# Altium schematic sheet Current_Sense.SchDoc
size OrCAD B; SheetNumber: 9; SheetTotal: 11
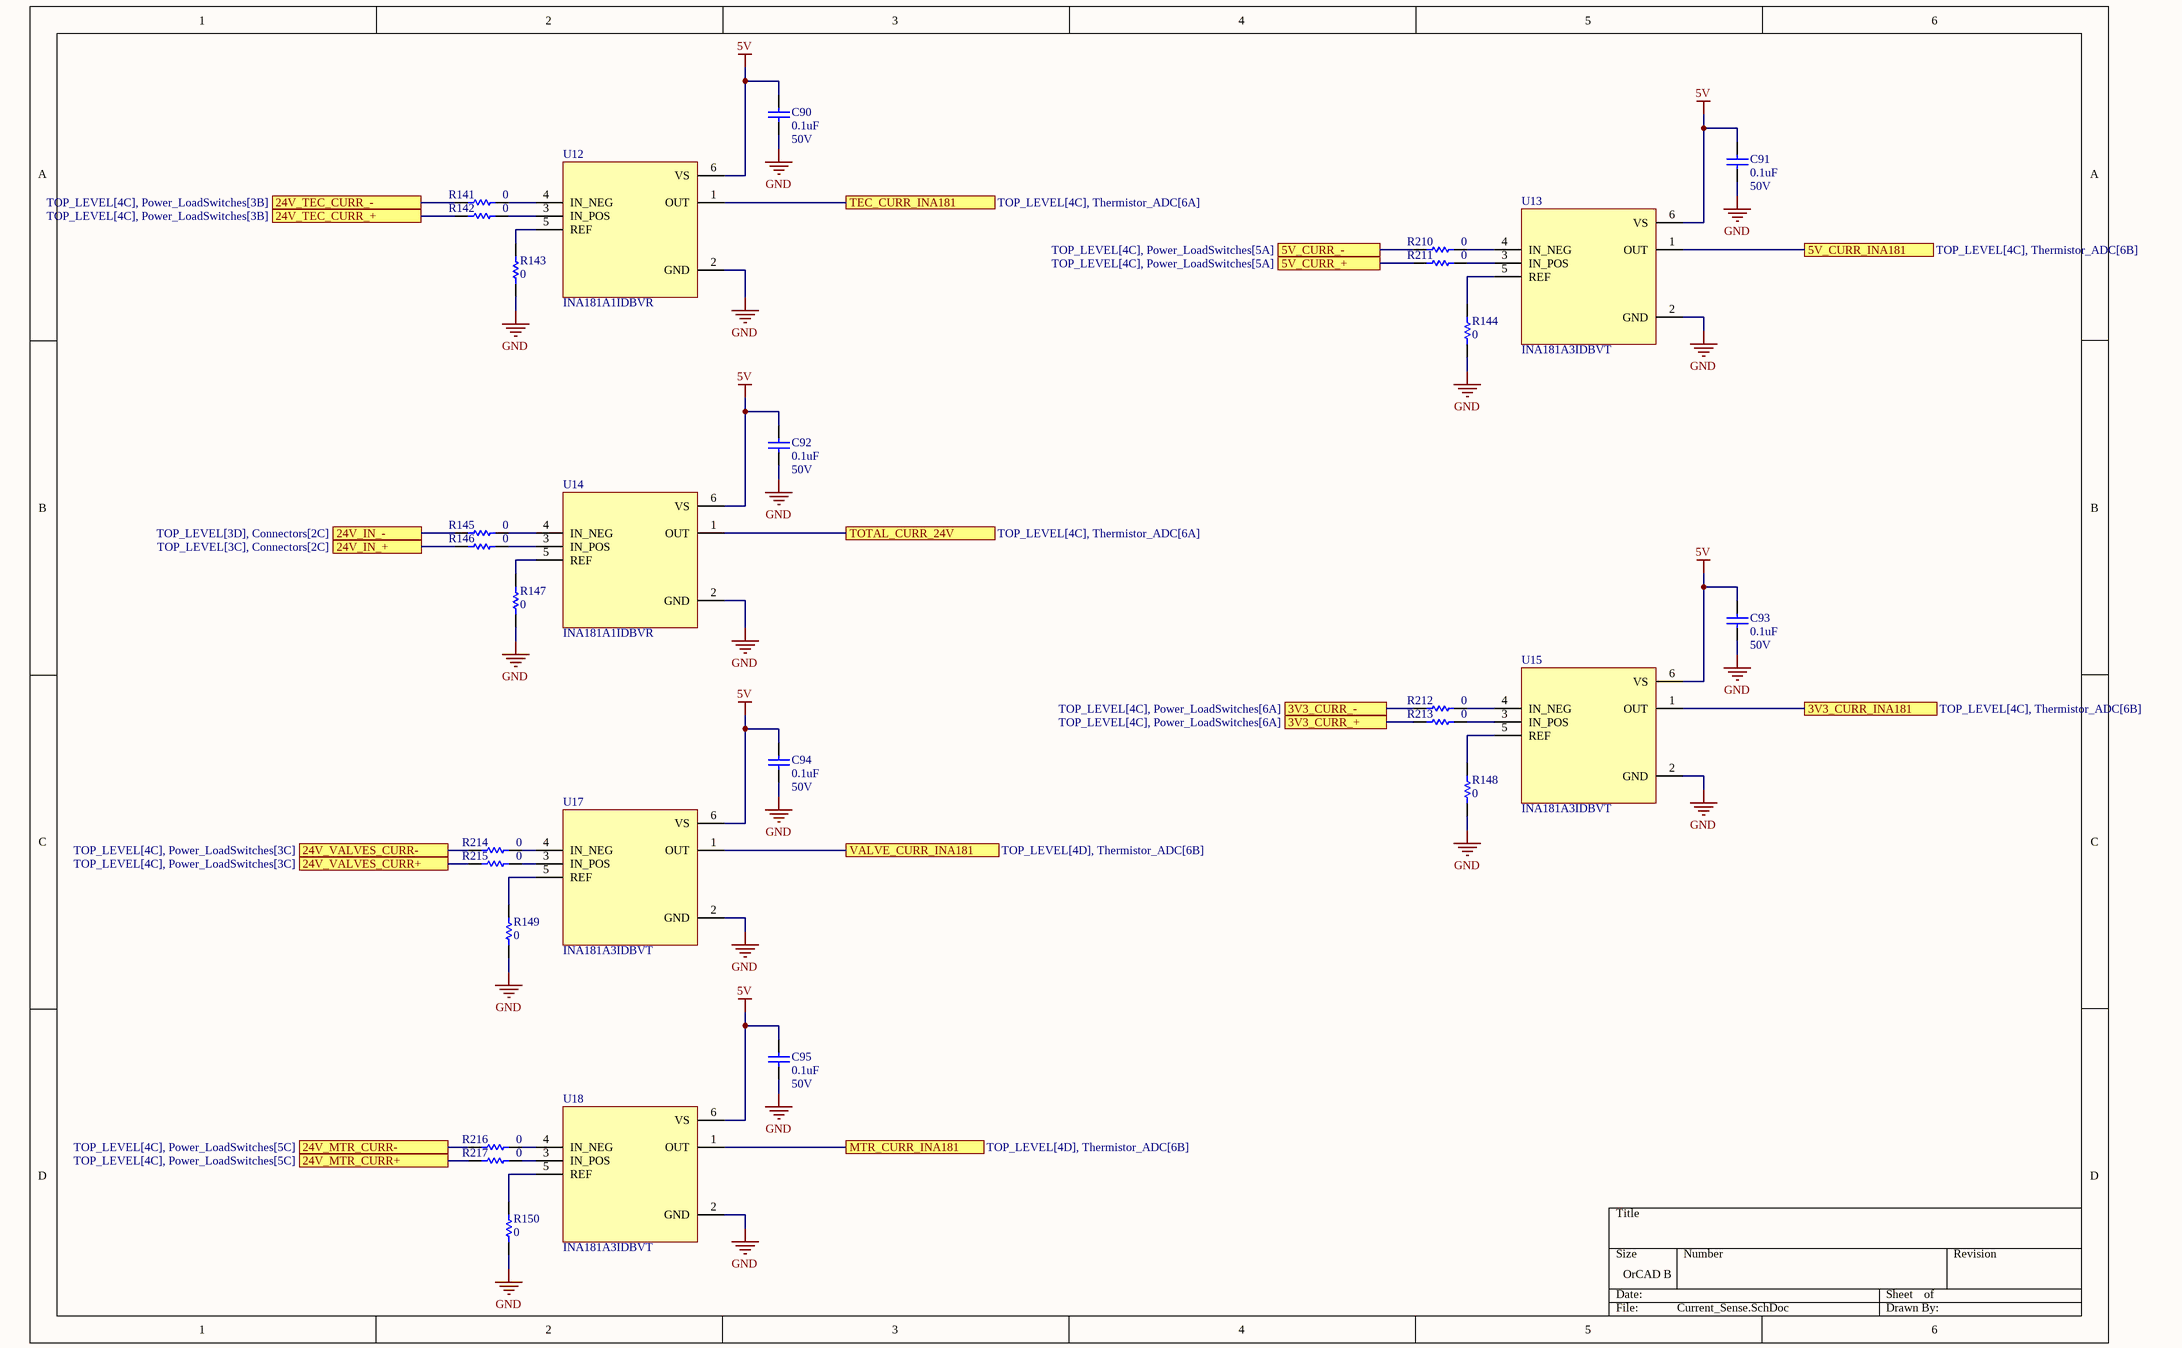
[diagram p0: Current_Sense.SchDoc]

## Parts
C90  value 0.1uF  Rating: 50V  [DEFAULT_CAPACITOR_0805]  (hidden comment: KGM21NR71H104KT)
C91  value 0.1uF  Rating: 50V  [DEFAULT_CAPACITOR_0805]  (hidden comment: KGM21NR71H104KT)
C92  value 0.1uF  Rating: 50V  [DEFAULT_CAPACITOR_0805]  (hidden comment: KGM21NR71H104KT)
C93  value 0.1uF  Rating: 50V  [DEFAULT_CAPACITOR_0805]  (hidden comment: KGM21NR71H104KT)
C94  value 0.1uF  Rating: 50V  [DEFAULT_CAPACITOR_0805]  (hidden comment: KGM21NR71H104KT)
C95  value 0.1uF  Rating: 50V  [DEFAULT_CAPACITOR_0805]  (hidden comment: KGM21NR71H104KT)
R141  value 0  [DEFAULT_RESISTOR_0805]  (hidden comment: RC0805JR-070RL)
R142  value 0  [DEFAULT_RESISTOR_0805]  (hidden comment: RC0805JR-070RL)
R143  value 0  [DEFAULT_RESISTOR_0805]  (hidden comment: RC0805JR-070RL)
R144  value 0  [DEFAULT_RESISTOR_0805]  (hidden comment: RC0805JR-070RL)
R145  value 0  [DEFAULT_RESISTOR_0805]  (hidden comment: RC0805JR-070RL)
R146  value 0  [DEFAULT_RESISTOR_0805]  (hidden comment: RC0805JR-070RL)
R147  value 0  [DEFAULT_RESISTOR_0805]  (hidden comment: RC0805JR-070RL)
R148  value 0  [DEFAULT_RESISTOR_0805]  (hidden comment: RC0805JR-070RL)
R149  value 0  [DEFAULT_RESISTOR_0805]  (hidden comment: RC0805JR-070RL)
R150  value 0  [DEFAULT_RESISTOR_0805]  (hidden comment: RC0805JR-070RL)
R210  value 0  [DEFAULT_RESISTOR_0805]  (hidden comment: RC0805JR-070RL)
R211  value 0  [DEFAULT_RESISTOR_0805]  (hidden comment: RC0805JR-070RL)
R212  value 0  [DEFAULT_RESISTOR_0805]  (hidden comment: RC0805JR-070RL)
R213  value 0  [DEFAULT_RESISTOR_0805]  (hidden comment: RC0805JR-070RL)
R214  value 0  [DEFAULT_RESISTOR_0805]  (hidden comment: RC0805JR-070RL)
R215  value 0  [DEFAULT_RESISTOR_0805]  (hidden comment: RC0805JR-070RL)
R216  value 0  [DEFAULT_RESISTOR_0805]  (hidden comment: RC0805JR-070RL)
R217  value 0  [DEFAULT_RESISTOR_0805]  (hidden comment: RC0805JR-070RL)
U12  INA181A1IDBVR  [INA181A1IDBVR]
U13  INA181A3IDBVT  [INA181A1IDBVR]
U14  INA181A1IDBVR  [INA181A1IDBVR]
U15  INA181A3IDBVT  [INA181A1IDBVR]
U17  INA181A3IDBVT  [INA181A1IDBVR]
U18  INA181A3IDBVT  [INA181A1IDBVR]

## Ports
3V3_CURR_+ (see TOP_LEVEL[4C], Power_LoadSwitches[6A]), 3V3_CURR_- (see TOP_LEVEL[4C], Power_LoadSwitches[6A]), 3V3_CURR_INA181 (see TOP_LEVEL[4C], Thermistor_ADC[6B]), 5V_CURR_+ (see TOP_LEVEL[4C], Power_LoadSwitches[5A]), 5V_CURR_- (see TOP_LEVEL[4C], Power_LoadSwitches[5A]), 5V_CURR_INA181 (see TOP_LEVEL[4C], Thermistor_ADC[6B]), 24V_IN_+ (see TOP_LEVEL[3C], Connectors[2C]), 24V_IN_- (see TOP_LEVEL[3D], Connectors[2C]), 24V_MTR_CURR+ (see TOP_LEVEL[4C], Power_LoadSwitches[5C]), 24V_MTR_CURR- (see TOP_LEVEL[4C], Power_LoadSwitches[5C]), 24V_TEC_CURR_+ (see TOP_LEVEL[4C], Power_LoadSwitches[3B]), 24V_TEC_CURR_- (see TOP_LEVEL[4C], Power_LoadSwitches[3B]), 24V_VALVES_CURR+ (see TOP_LEVEL[4C], Power_LoadSwitches[3C]), 24V_VALVES_CURR- (see TOP_LEVEL[4C], Power_LoadSwitches[3C]), MTR_CURR_INA181 (see TOP_LEVEL[4D], Thermistor_ADC[6B]), TEC_CURR_INA181 (see TOP_LEVEL[4C], Thermistor_ADC[6A]), TOTAL_CURR_24V (see TOP_LEVEL[4C], Thermistor_ADC[6A]), VALVE_CURR_INA181 (see TOP_LEVEL[4D], Thermistor_ADC[6B])

## Nets
5V: C90.2 C91.2 C92.2 C93.2 C94.2 C95.2 U12.6(VS) U13.6(VS) U14.6(VS) U15.6(VS) U17.6(VS) U18.6(VS)
GND: C90.1 C91.1 C92.1 C93.1 C94.1 C95.1 R143.2 R144.2 R147.2 R148.2 R149.2 R150.2 U12.2(GND) U13.2(GND) U14.2(GND) U15.2(GND) U17.2(GND) U18.2(GND)
3V3_CURR_+: R213.2 ; port 3V3_CURR_+
3V3_CURR_-: R212.2 ; port 3V3_CURR_-
3V3_CURR_INA181: U15.1(OUT) ; port 3V3_CURR_INA181
5V_CURR_+: R211.2 ; port 5V_CURR_+
5V_CURR_-: R210.2 ; port 5V_CURR_-
5V_CURR_INA181: U13.1(OUT) ; port 5V_CURR_INA181
24V_IN_+: R146.2 ; port 24V_IN_+
24V_IN_-: R145.2 ; port 24V_IN_-
24V_MTR_CURR+: R217.2 ; port 24V_MTR_CURR+
24V_MTR_CURR-: R216.2 ; port 24V_MTR_CURR-
24V_TEC_CURR_+: R142.2 ; port 24V_TEC_CURR_+
24V_TEC_CURR_-: R141.2 ; port 24V_TEC_CURR_-
24V_VALVES_CURR+: R215.2 ; port 24V_VALVES_CURR+
24V_VALVES_CURR-: R214.2 ; port 24V_VALVES_CURR-
MTR_CURR_INA181: U18.1(OUT) ; port MTR_CURR_INA181
TEC_CURR_INA181: U12.1(OUT) ; port TEC_CURR_INA181
TOTAL_CURR_24V: U14.1(OUT) ; port TOTAL_CURR_24V
VALVE_CURR_INA181: U17.1(OUT) ; port VALVE_CURR_INA181
NetR141_1: R141.1 U12.4(IN_NEG)
NetR142_1: R142.1 U12.3(IN_POS)
NetR143_1: R143.1 U12.5(REF)
NetR144_1: R144.1 U13.5(REF)
NetR145_1: R145.1 U14.4(IN_NEG)
NetR146_1: R146.1 U14.3(IN_POS)
NetR147_1: R147.1 U14.5(REF)
NetR148_1: R148.1 U15.5(REF)
NetR149_1: R149.1 U17.5(REF)
NetR150_1: R150.1 U18.5(REF)
NetR210_1: R210.1 U13.4(IN_NEG)
NetR211_1: R211.1 U13.3(IN_POS)
NetR212_1: R212.1 U15.4(IN_NEG)
NetR213_1: R213.1 U15.3(IN_POS)
NetR214_1: R214.1 U17.4(IN_NEG)
NetR215_1: R215.1 U17.3(IN_POS)
NetR216_1: R216.1 U18.4(IN_NEG)
NetR217_1: R217.1 U18.3(IN_POS)

## Library data of the parts
C90-C95 = KGM21NR71H104KT: CAP CER 0.1UF 50V X7R 0805; Manufacturer: Cal-Chip Electronics, Inc.; Manufacturer P/N: GMC55X7R226M50NT; MFR PN: KGM21NR71H104KT
R141-R150 R210-R217 = RC0805JR-070RL: RES 0 OHM JUMPER 1/8W 0805; Power: 1/8W; MFR PN: RC0805JR-070RL; Tolerance: *
U12 U14 = INA181A1IDBVR: IC CURR SENSE 1 CIRCUIT SOT23-6; MF: Texas Instruments; SnapEDA_Link: https://www.snapeda.com/parts/INA181A1IDBVR/Texas+Instruments/view-part/?ref=snap; Package: SOT-23-6 Texas Instruments; Value: *; MP: INA181A1IDBVR; Check_prices: https://www.snapeda.com/parts/INA181A1IDBVR/Texas+Instruments/view-part/?ref=eda; MFR PN: INA181A1IDBVR
U13 U15 U17 U18 = INA181A3IDBVT: IC CURR SENSE 1 CIRCUIT SOT23-6; MF: Texas Instruments; SnapEDA_Link: https://www.snapeda.com/parts/INA181A1IDBVR/Texas+Instruments/view-part/?ref=snap; Package: SOT-23-6 Texas Instruments; Value: *; MP: INA181A1IDBVR; Check_prices: https://www.snapeda.com/parts/INA181A1IDBVR/Texas+Instruments/view-part/?ref=eda; MFR PN: INA181A3IDBVT